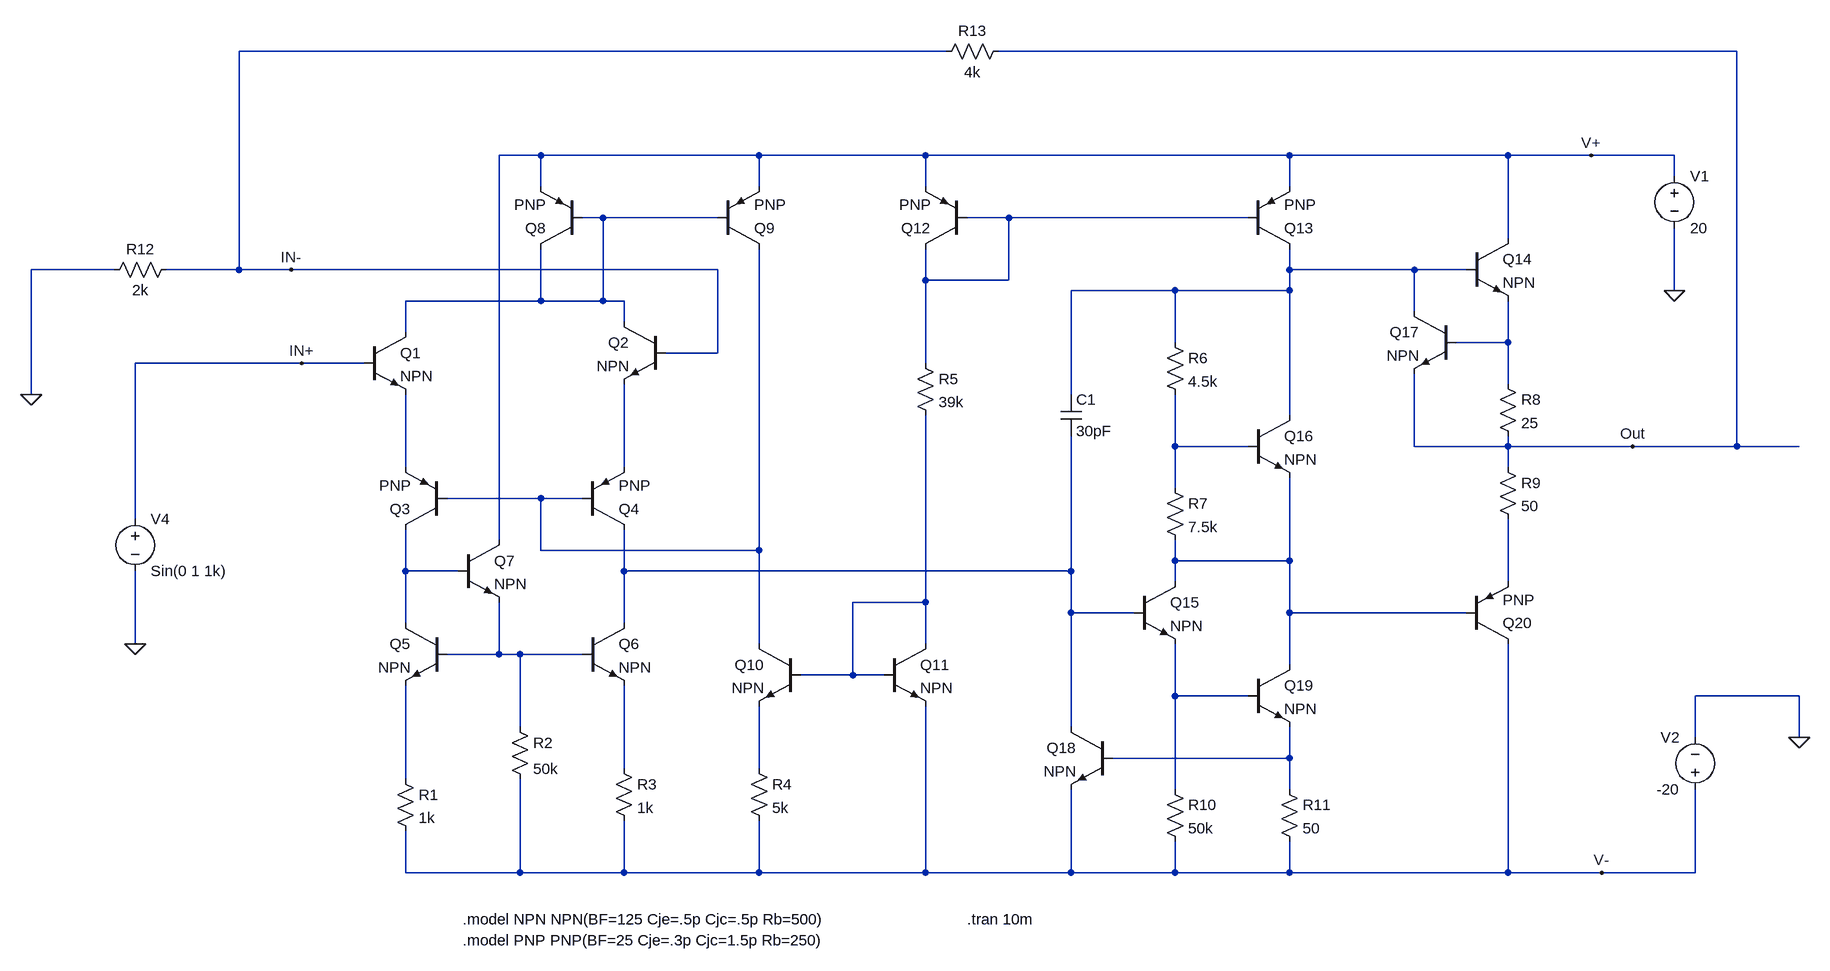
[diagram p0: schematic Non inverting amp.asc]
Non inverting amp.asc, the LTspice schematic file:
Version 4
SHEET 1 2772 1384
WIRE 912 -384 -176 -384
WIRE 2128 -384 992 -384
WIRE 288 -224 224 -224
WIRE 624 -224 288 -224
WIRE 880 -224 624 -224
WIRE 1440 -224 880 -224
WIRE 1776 -224 1440 -224
WIRE 1904 -224 1776 -224
WIRE 2032 -224 1904 -224
WIRE 2032 -192 2032 -224
WIRE 288 -176 288 -224
WIRE 624 -176 624 -224
WIRE 880 -176 880 -224
WIRE 1440 -176 1440 -224
WIRE 384 -128 352 -128
WIRE 560 -128 384 -128
WIRE 1008 -128 944 -128
WIRE 1376 -128 1008 -128
WIRE 1776 -96 1776 -224
WIRE -368 -48 -496 -48
WIRE -176 -48 -176 -384
WIRE -176 -48 -288 -48
WIRE -96 -48 -176 -48
WIRE 560 -48 -96 -48
WIRE 1440 -48 1440 -80
WIRE 1632 -48 1440 -48
WIRE 1712 -48 1632 -48
WIRE 880 -32 880 -80
WIRE 1008 -32 1008 -128
WIRE 1008 -32 880 -32
WIRE 1264 -16 1104 -16
WIRE 1440 -16 1440 -48
WIRE 1440 -16 1264 -16
WIRE 2032 -16 2032 -112
WIRE 288 0 288 -80
WIRE 288 0 80 0
WIRE 384 0 384 -128
WIRE 384 0 288 0
WIRE 416 0 384 0
WIRE 1632 16 1632 -48
WIRE 416 32 416 0
WIRE 80 48 80 0
WIRE 1264 64 1264 -16
WIRE 1776 64 1776 0
WIRE 1776 64 1696 64
WIRE 560 80 560 -48
WIRE 560 80 480 80
WIRE -80 96 -336 96
WIRE 16 96 -80 96
WIRE 880 96 880 -32
WIRE 1776 128 1776 64
WIRE -496 144 -496 -48
WIRE 1104 144 1104 -16
WIRE 1440 176 1440 -16
WIRE 1264 224 1264 144
WIRE 1376 224 1264 224
WIRE 1632 224 1632 112
WIRE 1776 224 1776 208
WIRE 1776 224 1632 224
WIRE 1968 224 1776 224
WIRE 2128 224 2128 -384
WIRE 2128 224 1968 224
WIRE 2224 224 2128 224
WIRE 80 256 80 144
WIRE 416 256 416 128
WIRE 1776 256 1776 224
WIRE 1264 288 1264 224
WIRE 288 304 144 304
WIRE 352 304 288 304
WIRE -336 336 -336 96
WIRE 224 368 224 -224
WIRE 288 384 288 304
WIRE 624 384 624 -80
WIRE 624 384 288 384
WIRE 1264 400 1264 368
WIRE 1440 400 1440 272
WIRE 1440 400 1264 400
WIRE 80 416 80 352
WIRE 160 416 80 416
WIRE 416 416 416 352
WIRE 1104 416 1104 208
WIRE 1104 416 416 416
WIRE 1264 432 1264 400
WIRE 1776 432 1776 336
WIRE 880 464 880 176
WIRE 880 464 768 464
WIRE 1104 480 1104 416
WIRE 1200 480 1104 480
WIRE 1440 480 1440 400
WIRE 1712 480 1440 480
WIRE 80 496 80 416
WIRE 416 496 416 416
WIRE -336 528 -336 416
WIRE 624 528 624 384
WIRE 880 528 880 464
WIRE 224 544 224 464
WIRE 224 544 144 544
WIRE 256 544 224 544
WIRE 352 544 256 544
WIRE 1440 560 1440 480
WIRE 768 576 768 464
WIRE 768 576 688 576
WIRE 816 576 768 576
WIRE 1264 608 1264 528
WIRE 1376 608 1264 608
WIRE 2224 608 2064 608
WIRE 256 656 256 544
WIRE 1104 656 1104 480
WIRE 2064 672 2064 608
WIRE 2224 672 2224 608
WIRE 1440 704 1440 656
WIRE 1440 704 1168 704
WIRE 416 720 416 592
WIRE 624 720 624 624
WIRE 80 736 80 592
WIRE 1264 752 1264 608
WIRE 1440 752 1440 704
WIRE 80 880 80 816
WIRE 256 880 256 736
WIRE 256 880 80 880
WIRE 416 880 416 800
WIRE 416 880 256 880
WIRE 624 880 624 800
WIRE 624 880 416 880
WIRE 880 880 880 624
WIRE 880 880 624 880
WIRE 1104 880 1104 752
WIRE 1104 880 880 880
WIRE 1264 880 1264 832
WIRE 1264 880 1104 880
WIRE 1440 880 1440 832
WIRE 1440 880 1264 880
WIRE 1776 880 1776 528
WIRE 1776 880 1440 880
WIRE 1920 880 1776 880
WIRE 2064 880 2064 752
WIRE 2064 880 1920 880
FLAG -80 96 IN+
FLAG -96 -48 IN-
FLAG 1904 -224 V+
FLAG 1920 880 V-
FLAG 1968 224 Out
FLAG 2224 672 0
FLAG 2032 -16 0
FLAG -336 528 0
FLAG -496 144 0
SYMBOL res 64 720 R0
SYMATTR InstName R1
SYMATTR Value 1k
SYMBOL res 240 640 R0
WINDOW 3 36 80 Left 2
SYMATTR Value 50k
SYMATTR InstName R2
SYMBOL res 400 704 R0
SYMATTR InstName R3
SYMATTR Value 1k
SYMBOL res 608 704 R0
SYMATTR InstName R4
SYMATTR Value 5k
SYMBOL res 864 80 R0
SYMATTR InstName R5
SYMATTR Value 39k
SYMBOL res 1248 48 R0
SYMATTR InstName R6
SYMATTR Value 4.5k
SYMBOL res 1248 272 R0
SYMATTR InstName R7
SYMATTR Value 7.5k
SYMBOL res 1760 112 R0
SYMATTR InstName R8
SYMATTR Value 25
SYMBOL res 1760 240 R0
SYMATTR InstName R9
SYMATTR Value 50
SYMBOL res 1248 736 R0
SYMATTR InstName R10
SYMATTR Value 50k
SYMBOL res 1424 736 R0
SYMATTR InstName R11
SYMATTR Value 50
SYMBOL cap 1088 144 R0
SYMATTR InstName C1
SYMATTR Value 30pF
SYMBOL voltage 2032 -208 R0
SYMATTR InstName V1
SYMATTR Value 20
SYMBOL voltage 2064 768 R180
WINDOW 0 24 96 Left 2
WINDOW 3 24 16 Left 2
SYMATTR InstName V2
SYMATTR Value -20
SYMBOL npn 16 48 R0
SYMATTR InstName Q1
SYMBOL npn 160 368 R0
SYMATTR InstName Q7
SYMBOL npn 352 496 R0
SYMATTR InstName Q6
SYMBOL npn 144 496 M0
SYMATTR InstName Q5
SYMBOL npn 480 32 M0
SYMATTR InstName Q2
SYMBOL npn 688 528 M0
SYMATTR InstName Q10
SYMBOL npn 816 528 R0
SYMATTR InstName Q11
SYMBOL npn 1168 656 M0
SYMATTR InstName Q18
SYMBOL npn 1200 432 R0
SYMATTR InstName Q15
SYMBOL npn 1376 560 R0
SYMATTR InstName Q19
SYMBOL pnp 352 -80 R180
SYMATTR InstName Q8
SYMBOL pnp 560 -80 M180
SYMATTR InstName Q9
SYMBOL pnp 944 -80 R180
SYMATTR InstName Q12
SYMBOL pnp 1376 -80 M180
SYMATTR InstName Q13
SYMBOL pnp 144 352 R180
SYMATTR InstName Q3
SYMBOL pnp 352 352 M180
SYMATTR InstName Q4
SYMBOL pnp 1712 528 M180
SYMATTR InstName Q20
SYMBOL npn 1376 176 R0
SYMATTR InstName Q16
SYMBOL npn 1696 16 M0
SYMATTR InstName Q17
SYMBOL npn 1712 -96 R0
SYMATTR InstName Q14
SYMBOL res 1008 -400 R90
WINDOW 0 0 56 VBottom 2
WINDOW 3 32 56 VTop 2
SYMATTR InstName R13
SYMATTR Value 4k
SYMBOL res -272 -64 R90
WINDOW 0 0 56 VBottom 2
WINDOW 3 32 56 VTop 2
SYMATTR InstName R12
SYMATTR Value 2k
SYMBOL voltage -336 320 R0
SYMATTR InstName V4
SYMATTR Value Sin(0 1 1k)
TEXT 168 952 Left 2 !.model NPN NPN(BF=125 Cje=.5p Cjc=.5p Rb=500)
TEXT 168 984 Left 2 !.model PNP PNP(BF=25 Cje=.3p Cjc=1.5p Rb=250)
TEXT 944 952 Left 2 !.tran 10m

The netlist it stands for:
* Non inverting amp.asc
R1 N019 V- 1k
R2 N014 V- 50k
R3 N017 V- 1k
R4 N018 V- 5k
R5 N002 N013 39k
R6 N003 N005 4.5k
R7 N005 N009 7.5k
R8 N004 Out 25
R9 Out N012 50
R10 N015 V- 50k
R11 N016 V- 50
C1 N003 N011 30pF
V1 V+ 0 20
V2 V- 0 -20
Q1 N001 IN+ N006 0 NPN
Q7 V+ N010 N014 0 NPN
Q6 N011 N014 N017 0 NPN
Q5 N010 N014 N019 0 NPN
Q2 N001 IN- N007 0 NPN
Q10 N008 N013 N018 0 NPN
Q11 N013 N013 V- 0 NPN
Q18 N011 N016 V- 0 NPN
Q15 N009 N011 N015 0 NPN
Q19 N009 N015 N016 0 NPN
Q8 N001 N001 V+ 0 PNP
Q9 N008 N001 V+ 0 PNP
Q12 N002 N002 V+ 0 PNP
Q13 N003 N002 V+ 0 PNP
Q3 N010 N008 N006 0 PNP
Q4 N011 N008 N007 0 PNP
Q20 V- N009 N012 0 PNP
Q16 N003 N005 N009 0 NPN
Q17 N003 N004 Out 0 NPN
Q14 V+ N003 N004 0 NPN
R13 Out IN- 4k
R12 IN- 0 2k
V4 IN+ 0 Sin(0 1 1k)
.model NPN NPN
.model PNP PNP
.lib standard.bjt
.model NPN NPN(BF=125 Cje=.5p Cjc=.5p Rb=500)
.model PNP PNP(BF=25 Cje=.3p Cjc=1.5p Rb=250)
.tran 10m
.backanno
.end